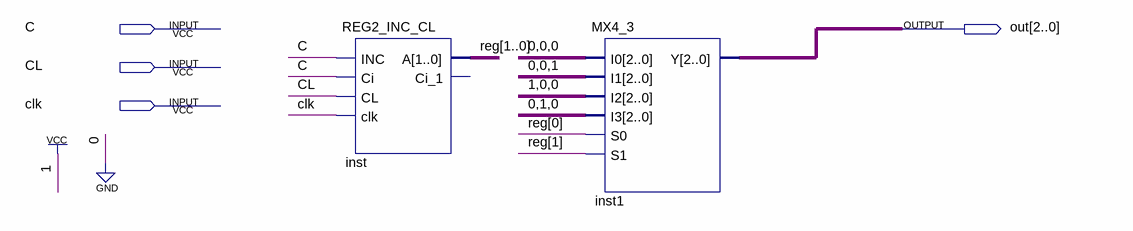
[diagram p0: schematic sheet]
// Quartus schematic main1.bdf as structural Verilog: 2 symbols, 4 pins
module main1 (
  input  C,
  input  CL,
  input  clk,
  output [2:0] out
);

  wire [1:0] \reg ;

  REG2_INC_CL inst (.INC(C), .Ci(C), .CL(CL), .clk(clk), .A(\reg ));  // open: Ci_1
  MX4_3 inst1 (.I0(3'b000), .I1(3'b001), .I2(3'b100), .I3(3'b010), .S0(\reg [0]), .S1(\reg [1]), .Y(out));
endmodule
